# EAGLE design G1Tech-LTC1966 (EAGLE 9.0.0)
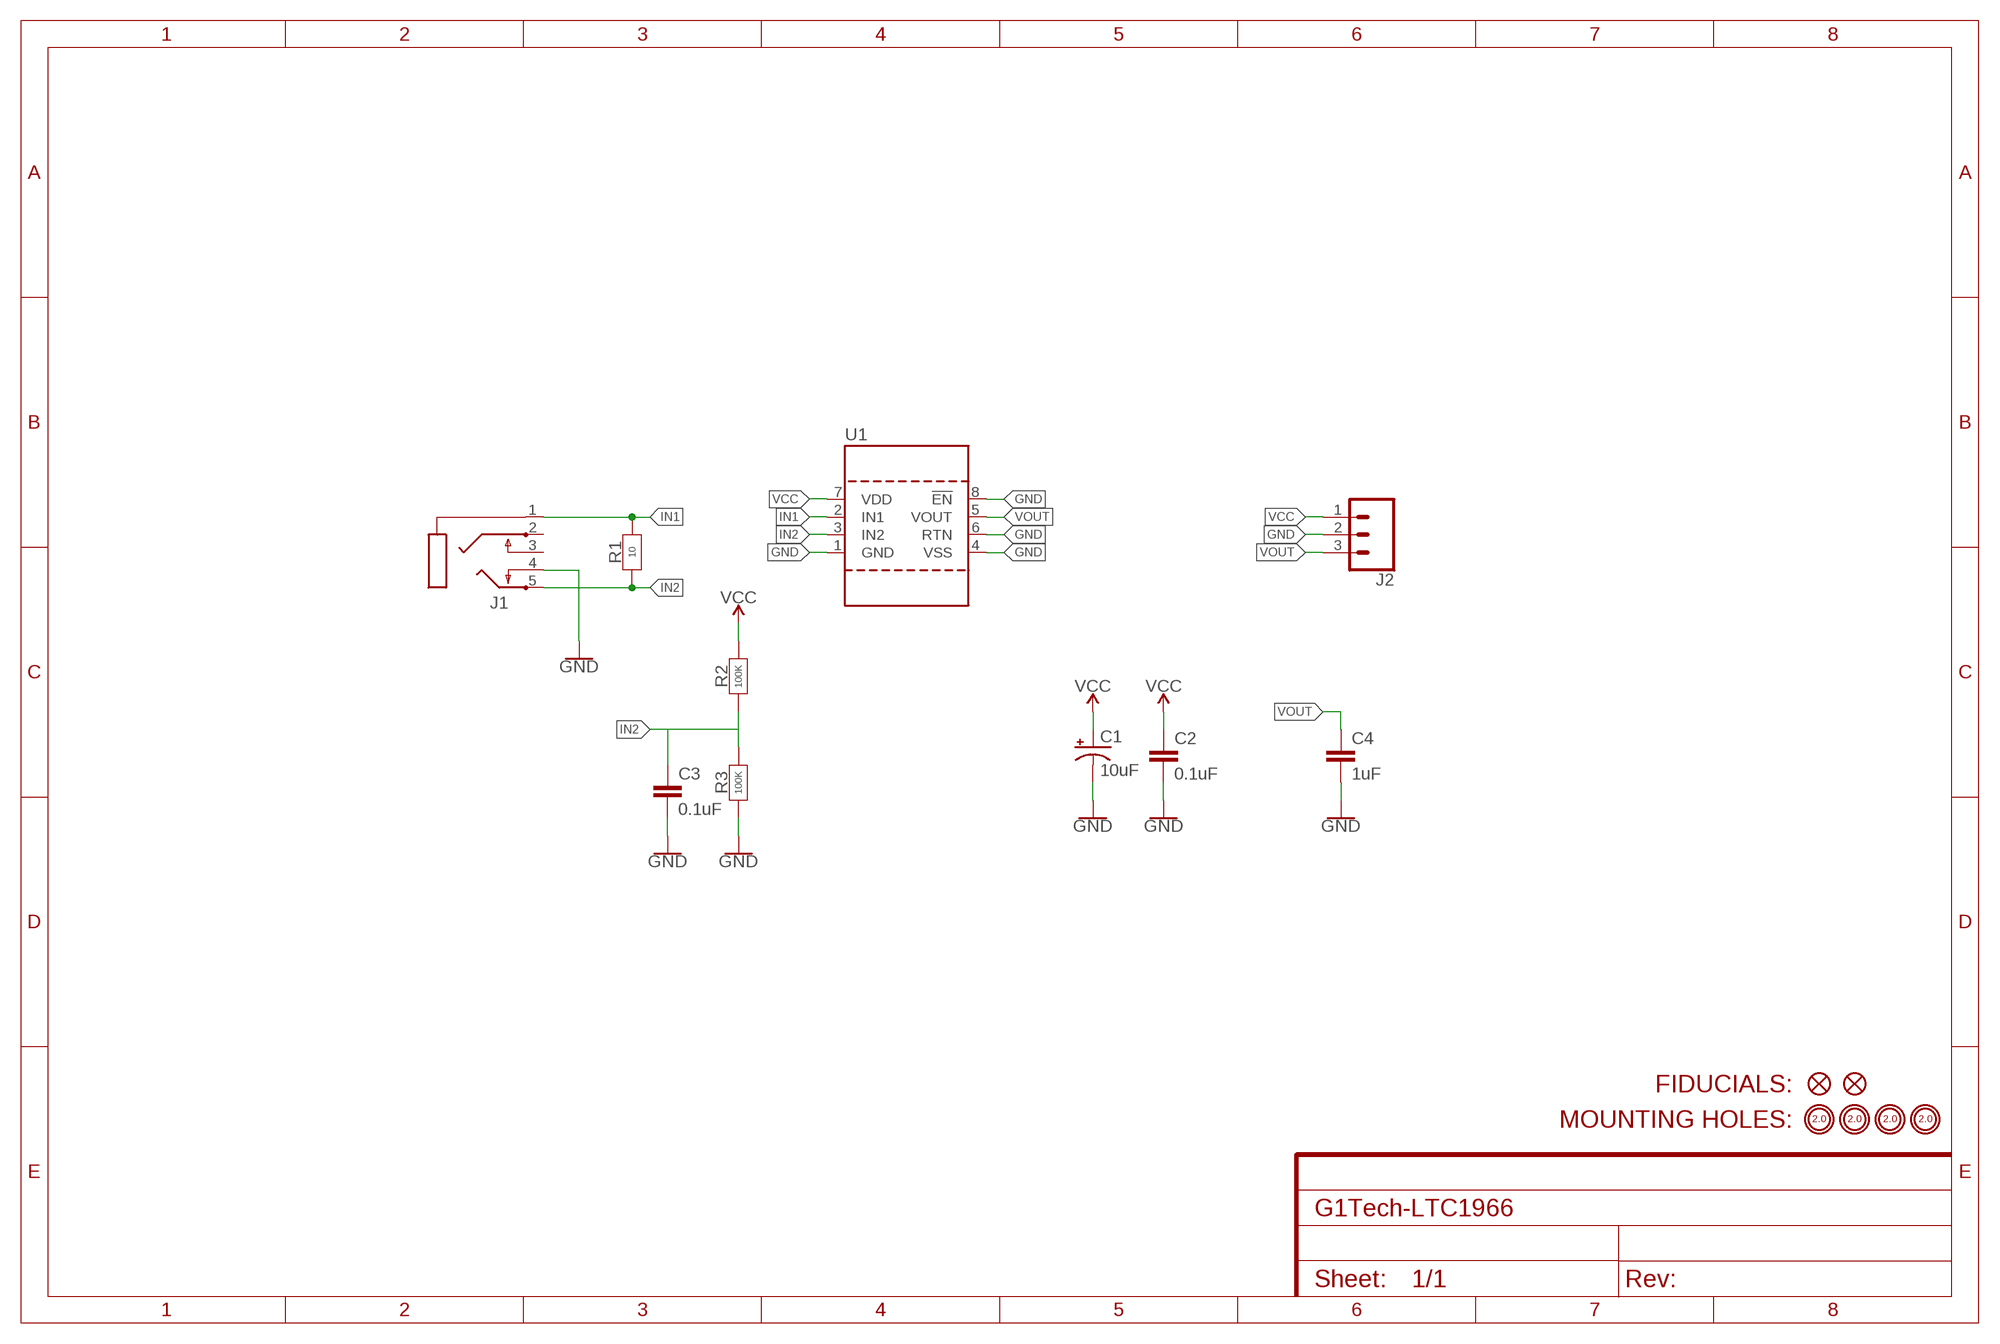
[diagram p0: schematic, sheet 1]

## Parts
C1  10uF  C-TYPE-A  [TYPE-A]
C2  0.1uF  C0603  [C0603]
C3  0.1uF  C0603  [C0603]
C4  1uF  C0603  [C0603]
FD1  FIDUCIAL-1X2  [FIDUCIAL-1X2]
FD2  FIDUCIAL-1X2  [FIDUCIAL-1X2]
H1  MOUNTINGHOLE-PLATED-2.0  [MOUNTINGHOLE-PLATED-2.0]
H2  MOUNTINGHOLE-PLATED-2.0  [MOUNTINGHOLE-PLATED-2.0]
H3  MOUNTINGHOLE-PLATED-2.0  [MOUNTINGHOLE-PLATED-2.0]
H4  MOUNTINGHOLE-PLATED-2.0  [MOUNTINGHOLE-PLATED-2.0]
J1  PJ-3126-5A  [PJ-3126-5A]
J2  CONN-1X3  [1X03_NO_SILK]
R1  10  YAGEO-R0603  [YAGEO-R0603]
R2  100K  YAGEO-R0603  [YAGEO-R0603]
R3  100K  YAGEO-R0603  [YAGEO-R0603]
U1  LTC1966  [MS8]

## Nets
GND: C1.C C2.2 C3.2 C4.2 J1.4 J2.2 R3.1 U1.1(GND) U1.4(VSS) U1.6(RTN) U1.8(!EN)
IN1: J1.1 R1.2 U1.2(IN1)
IN2: C3.1 J1.5 R1.1 R2.1 R3.2 U1.3(IN2)
VCC: C1.A C2.1 J2.1 R2.2 U1.7(VDD)
VOUT: C4.1 J2.3 U1.5(VOUT)
Unconnected: J1.2 J1.3

## Library data of the parts
C1 = G1Tech-Capacitors:C-TYPE-A
C2-C4 = G1Tech-Capacitors:C0603
FD1 FD2 = G1Tech-Design:FIDUCIAL-1X2
H1-H4 = G1Tech-Design:MOUNTINGHOLE-PLATED-2.0
J1 = G1Tech-Connectors:PJ-3126-5A
J2 = G1Tech-Connectors:CONN-1X3
R1-R3 = G1Tech-Resistors:YAGEO-R0603: YAGEO Resistor R0603
U1 = G1Tech-Integrated-Circuits:LTC1966

## Board
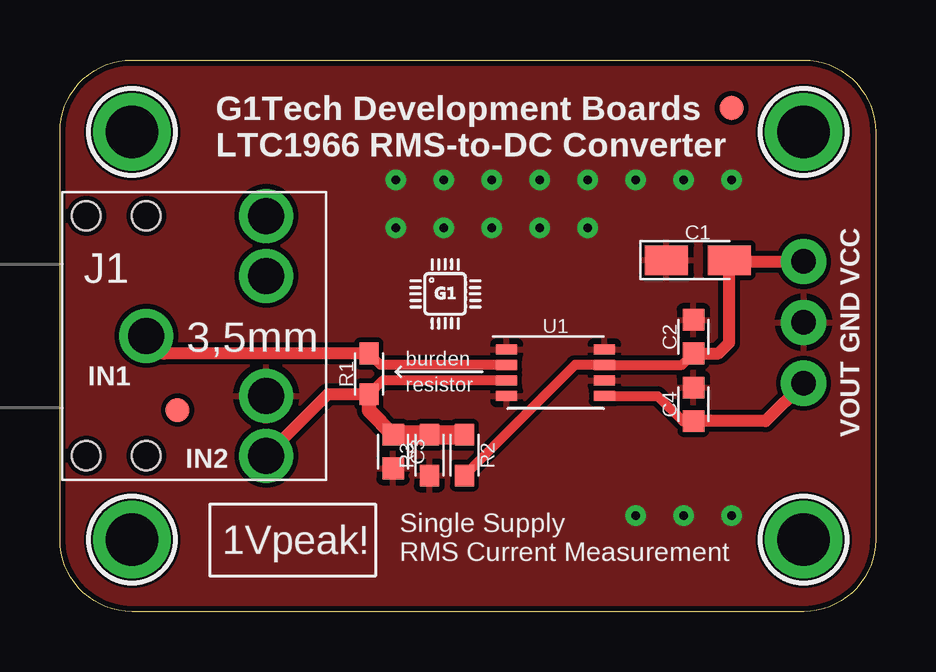
[diagram p1: board, top side]
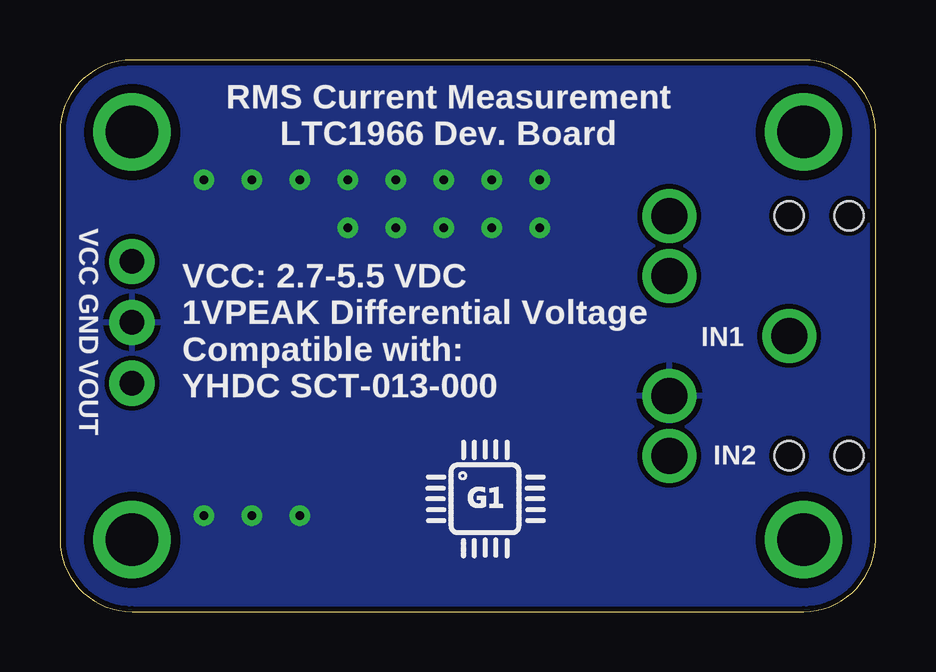
[diagram p2: board, bottom side, seen from below]

Size 34 x 23 mm. Coordinates in mm from the lower left corner, seen from the top.
Outline: 0,3 0,20 arc-90 3,23 31,23 arc-90 34,20 34,3 arc-90 31,0 3,0 arc-90 0,3
Copper layers (1*16): Top 0.035mm / dielectric 1.5mm / Bottom 0.035mm
Design rules "SparkFun": minimum track width 8mil, minimum drill 20mil, track to track 8mil, track to pad 8mil, pad to pad 8mil, via to via 8mil, smd to smd 8mil, copper to edge 9mil, drill to drill 8mil, minimum pad ring 12mil, minimum via ring 10mil, stop-mask expansion 4mil, vias tented up to drill 20mil, thermal gap 10mil

### Footprints (pad centres in the part's own frame; a part is rotated, then mirrored left to right if it is on the bottom)
TYPE-A = smd 1.8 x 1.23: A 1.31,0; C -1.31,0
C0603 = smd 0.9 x 0.9: 1 -0.7,0; 2 0.7,0
FIDUCIAL-1X2 = smd 1 x 1: 1 0,0
MOUNTINGHOLE-PLATED-2.0 = drill 2.2: P$1 0,0
PJ-3126-5A = drill 1.5: 1 -5,0; 2 0,5; 3 0,2.5; 4 0,-2.5; 5 0,-5 | hole 1.2: -5,5; -7.5,5; -7.5,-5; -5,-5
1X03_NO_SILK = drill 1.016 pad 1.88: 1 0,0; 2 2.54,0; 3 5.08,0
YAGEO-R0603 = smd 0.9 x 0.8: 1 -0.85,0; 2 0.85,0
MS8 = smd 0.42 x 0.88: 1 -0.975,-2.04; 2 -0.325,-2.04; 3 0.325,-2.04; 4 0.975,-2.04; 5 0.975,2.04; 6 0.325,2.04; 7 -0.325,2.04; 8 -0.975,2.04

### Placement (x,y rotation side)
C1  26.59,14.65 0 top
C2  26.41,11.46 90 top
C3  13.89,6.67 270 top
C4  26.41,8.64 90 top
FD1  28,21 0 top
FD2  4.9,8.4 0 top
H1  3,20 0 top
H2  31,20 0 top
H3  31,3 0 top
H4  3,3 0 top
J1  8.6,11.5 0 top
J2  31,14.6 270 top
R1  12.88,9.91 90 top
R2  16.86,6.52 270 top
R3  15.4,6.52 90 top
U1  20.66,9.96 270 top
U$1  [LOGO-G1TECH-5MM]  18.75,2.23 0 bottom
U$2  [LOGO-G1TECH-3MM]  14.57,11.76 0 top

### Tracks (layer width: path | path; a pad name or v marks a point on that pad's centre or on a via)
GND  (via drill 0.35)
  other vias: 14,18 14,16 16,16 18,16 20,16 22,16 16,18 18,18 20,18 22,18 24,18 26,18 28,18 28,4 26,4 24,4
  pour Top: 0,0 0,23 34,23 34,0
  pour Bottom: 0,0 0,23 34,23 34,0
IN1
  Top 0.406: 13,10.54 R1.2 13.36,10.29 U1.2
  Top 0.508: R1.2 4.34,10.76 J1.1
IN2
  Top 0.305: 13.09,9.28 R1.1
  Top 0.406: 13.05,9.28 R1.1 13.45,9.63 U1.3
  Top 0.508: R1.1 11.16,9.06 J1.5
  Top 0.61: R1.1 12.88,8.38 C3.1
  Top 0.813: R2.1 R3.2 C3.1
VCC
  Top 0.406: 26.2,10.54 C2.1 | R2.2 21.48,10.29 U1.7 25.94,10.29 C2.1
  Top 0.508: J2.1 27.95,14.6 C1.A 27.9,11.21 27.45,10.77 C2.1
VOUT
  Top 0.406: U1.5 24.91,8.98 25.96,7.94 C4.1
  Top 0.508: J2.3 29.42,7.94 C4.1 26.34,8.01

### Text on the board
tPlace: G1Tech Development Boards / LTC1966 RMS-to-DC Converter | VCC | GND | IN1 | burden / resistor | VOUT | IN2 | 1Vpeak! | Single Supply / RMS Current Measurement
bPlace: RMS Current Measurement / LTC1966 Dev. Board | VCC | VCC: 2.7-5.5 VDC / 1VPEAK Differential Voltage / Compatible with: / YHDC SCT-013-000 | GND | IN1 | VOUT | IN2